# Altium schematic sheet esquematico.SchDoc
size A4; SheetNumber: 1; SheetTotal: 1
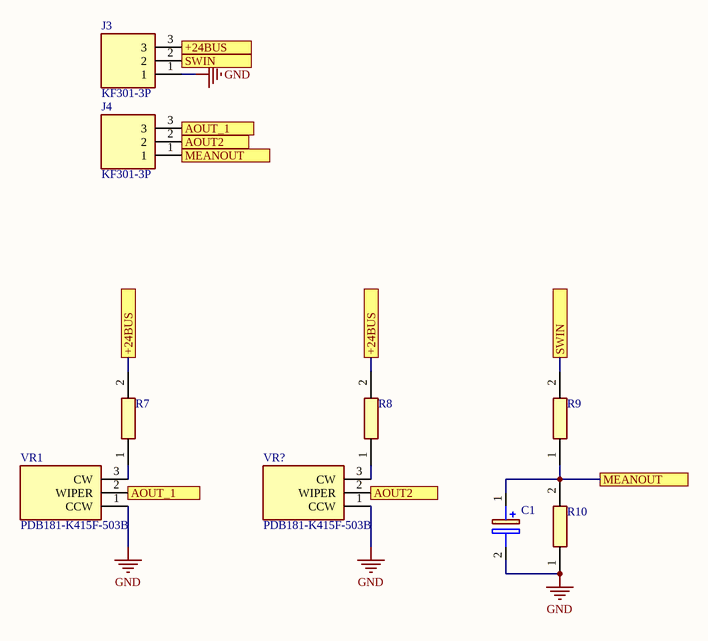
[diagram p0: esquematico.SchDoc]

## Parts
C1  ECA-1HHG330  [CAPPRD200W55D500H1200]  (value not drawn)
J3  KF301-3P  [KF3013P]
J4  KF301-3P  [KF3013P]
R7  MRS25000C1402FCT00  [RESAD1650W60L650D250]  (value not drawn)
R8  MRS25000C1402FCT00  [RESAD1650W60L650D250]  (value not drawn)
R9  MRS25000C1402FCT00  [RESAD1650W60L650D250]  (value not drawn)
R10  MRS25000C1402FCT00  [RESAD1650W60L650D250]  (value not drawn)
VR1  PDB181-K415F-503B  [PDB181K415F503B]
VR?  PDB181-K415F-503B  [PDB181K415F503B]

## Ports
+24BUS (see esquematico[1B], esquematico[1C]), +24BUS (see esquematico[1B], esquematico[2C]), +24BUS (see esquematico[1C], esquematico[2C]), AOUT2 (see esquematico[1B]), AOUT2 (see esquematico[2D]), AOUT_1 (see esquematico[1B]), AOUT_1 (see esquematico[1D]), MEANOUT (see esquematico[1B]), MEANOUT (see esquematico[2D]), SWIN (see esquematico[1B]), SWIN (see esquematico[2C])

## Nets
GND: C1.2(-) J3.1 R10.1 VR1.1(CCW) VR?.1(CCW)
+24BUS: J3.3 R7.2 R8.2 ; port +24BUS
AOUT2: J4.2 VR?.2(WIPER) ; port AOUT2
AOUT_1: J4.3 VR1.2(WIPER) ; port AOUT_1
MEANOUT: C1.1(+) J4.1 R9.1 R10.2 ; port MEANOUT
SWIN: J3.2 R9.2 ; port SWIN
NetR7_1: R7.1 VR1.3(CW)
NetR8_1: R8.1 VR?.3(CW)

## Library data of the parts
C1 = ECA-1HHG330: Capacitor Polarised; Manufacturer_Name: Panasonic; Datasheet Link: http://industrial.panasonic.com/cdbs/www-data/pdf/RDF0000/ABA0000C1215.pdf; Height: 12mm; Manufacturer_Part_Number: ECA-1HHG330; Mouser Part Number: 667-ECA-1HHG330; Mouser Price/Stock: https://www.mouser.co.uk/ProductDetail/Panasonic/ECA-1HHG330?qs=UkbntSQVHlYh%2Fs1VDyf2Bw%3D%3D; Arrow Part Number: ECA-1HHG330; Arrow Price/Stock: https://www.arrow.com/en/products/eca-1hhg330/panasonic?region=europe
J3 J4 = KF301-3P: Connector; Manufacturer_Name: Handson Technology; Datasheet Link: http://www.handsontec.com/dataspecs/terminal%20block-5mm.pdf; Height: 10mm; Manufacturer_Part_Number: KF301-3P
R7-R10 = MRS25000C1402FCT00: Resistor; Manufacturer_Name: Vishay; Datasheet Link: http://www.vishay.com/docs/28724/mrs16m25.pdf; Manufacturer_Part_Number: MRS25000C1402FCT00
VR1 VR? = PDB181-K415F-503B: Variable Resistor; Manufacturer_Name: Bourns; Datasheet Link: https://componentsearchengine.com//PDB181-K415F-503B.pdf; Height: 16.5mm; Manufacturer_Part_Number: PDB181-K415F-503B; Mouser Part Number: 652-PDB181K415F503B; Mouser Price/Stock: https://www.mouser.co.uk/ProductDetail/Bourns/PDB181-K415F-503B?qs=fgHA1UgJI8CfxbrAh7xxKw%3D%3D